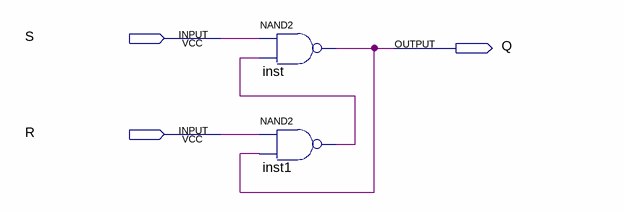
[diagram p0: schematic sheet]
// Quartus schematic SR_Latch.bdf as structural Verilog: 2 symbols, 3 pins
module SR_Latch (
  input  S,
  input  R,
  output Q
);

  wire inst1_out;

  nand inst (Q, S, inst1_out);
  nand inst1 (inst1_out, R, Q);
endmodule
